# Altium schematic sheet Controller-Test-Board.SchDoc
size A4
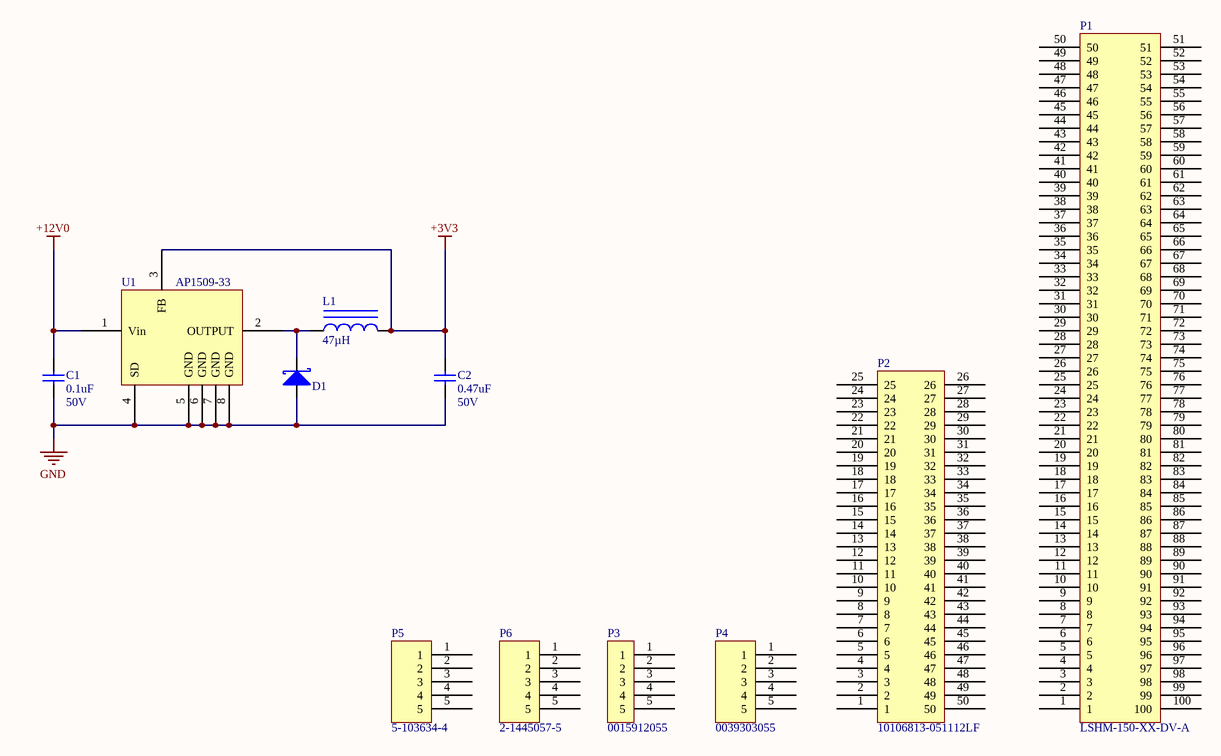
[diagram p0: Controller-Test-Board.SchDoc]

## Parts
C1  0.1uF  Voltage: 50V  [6-0805_N]
C2  0.47uF  Voltage: 50V  [6-0805_N]
D1  DIODE SCHOTTKY PWR 100V 2A SMA  [SMA]  (value not drawn)
L1  47µH  [1264EY-470M=P3]
P1  LSHM-150-XX-DV-A  [LSHM-150-XX-DV-A]
P2  10106813-051112LF  [10106813-051112LF]
P3  0015912055  [0015912055]
P4  0039303055  [0039303055]
P5  5-103634-4  [5-103634-4]
P6  2-1445057-5  [2-1445057-5]
U1  AP1509-33  [8SOIC]

## Nets
+3V3: C2.2 L1.2 U1.3(FB)
+12V0: C1.2 U1.1(Vin)
GND: C1.1 C2.1 D1.A U1.4(SD) U1.5(GND) U1.6(GND) U1.7(GND) U1.8(GND)
NetD1_K: D1.K L1.1 U1.2(OUTPUT)

Not connected (* = marked no-connect by the designer): P1 1 2 3 4 5 6 7 8 9 10 11 12 13 14 15 16 17 18 19 20 21 22 23 24 25 26 27 28 29 30 31 32 33 34 35 36 37 38 39 40 41 42 43 44 45 46 47 48 49 50 51 52 53 54 55 56 57 58 59 60 61 62 63 64 65 66 67 68 69 70 71 72 73 74 75 76 77 78 79 80 81 82 83 84 85 86 87 88 89 90 91 92 93 94 95 96 97 98 99 100; P2 1 2 3 4 5 6 7 8 9 10 11 12 13 14 15 16 17 18 19 20 21 22 23 24 25 26 27 28 29 30 31 32 33 34 35 36 37 38 39 40 41 42 43 44 45 46 47 48 49 50; P3 1 2 3 4 5; P4 1 2 3 4 5; P5 1 2 3 4 5; P6 1 2 3 4 5

## Library data of the parts
C1 = CAP CER 0.1UF 50V 10% X7R 0805: Manufacturer: AVX Corporation; ManufacturerPartNumber: 08055C104K4Z2A; Value: 0.1uF; Supplier: Digi-Key; SupplierPartNumber: 478-6048-1-ND; Description: CAP CER 0.1UF 50V 10% X7R 0805
C2 = CAP CER 0.47UF 50V 10% X7R 0805: ManufacturerPartNumber: *; Value: 0.47uF
D1 = DIODE SCHOTTKY PWR 100V 2A SMA: Manufacturer: STMicroelectronics; ManufacturerPartNumber: STPS2H100A; Description: DIODE SCHOTTKY 100V 2A SMA; Supplier Part Number: 497-3758-1-ND; Supplier: Digi-Key
L1 = IND 3.3UH FERRITE 1.04A: Manufacturer: TDK Corporation; Manufacturer Part Number: VLS201612CX-3R3M; Description: FIXED IND 3.3UH 1.37A 170 MOHM; Type: Wirewound; Tolerance: ±20%; Current Rating: 1.37A; Current - Saturation: 1.04A; Shielding: Shielded; DC Resistance (DCR): 170 mOhm Max; Frequency - Test: 1MHz; Supplier 1: Digi-Key; Supplier Part Number 1: 445-172964-1-ND; RoHS: RoHS Compliant; Category: Inductors, Coils, Chokes; Stock 1: 4000; Pricing 1: 1=0.43, 10=0.387, 50=0.3014, 100=0.2798, 500=0.24538, 1000=0.19803 (USD); Packaging: Cut Tape (CT); Material - Core: Ferrite; Q @ Freq: -; Frequency - Self Resonant: -; Operating Temperature: -40°C ~ 105°C; Mounting Type: Surface Mount; Package / Case: Nonstandard; Size / Dimension: 0.079" L x 0.063" W (2.00mm x 1.60mm); Height - Seated (Max): 0.047" (1.20mm); Supplier Device Package: 2016; ComponentLink1URL: http://product.tdk.com/en/catalog/datasheets/inductor_commercial_power_vls-cx_en.pdf; ComponentLink1Description: http://product.tdk.com/en/catalog/datasheets/inductor_commercial_power_vls-cx_en.pdf; Inductance: 47µH